# Altium schematic sheet _i2c1.SchDoc
size Tabloid
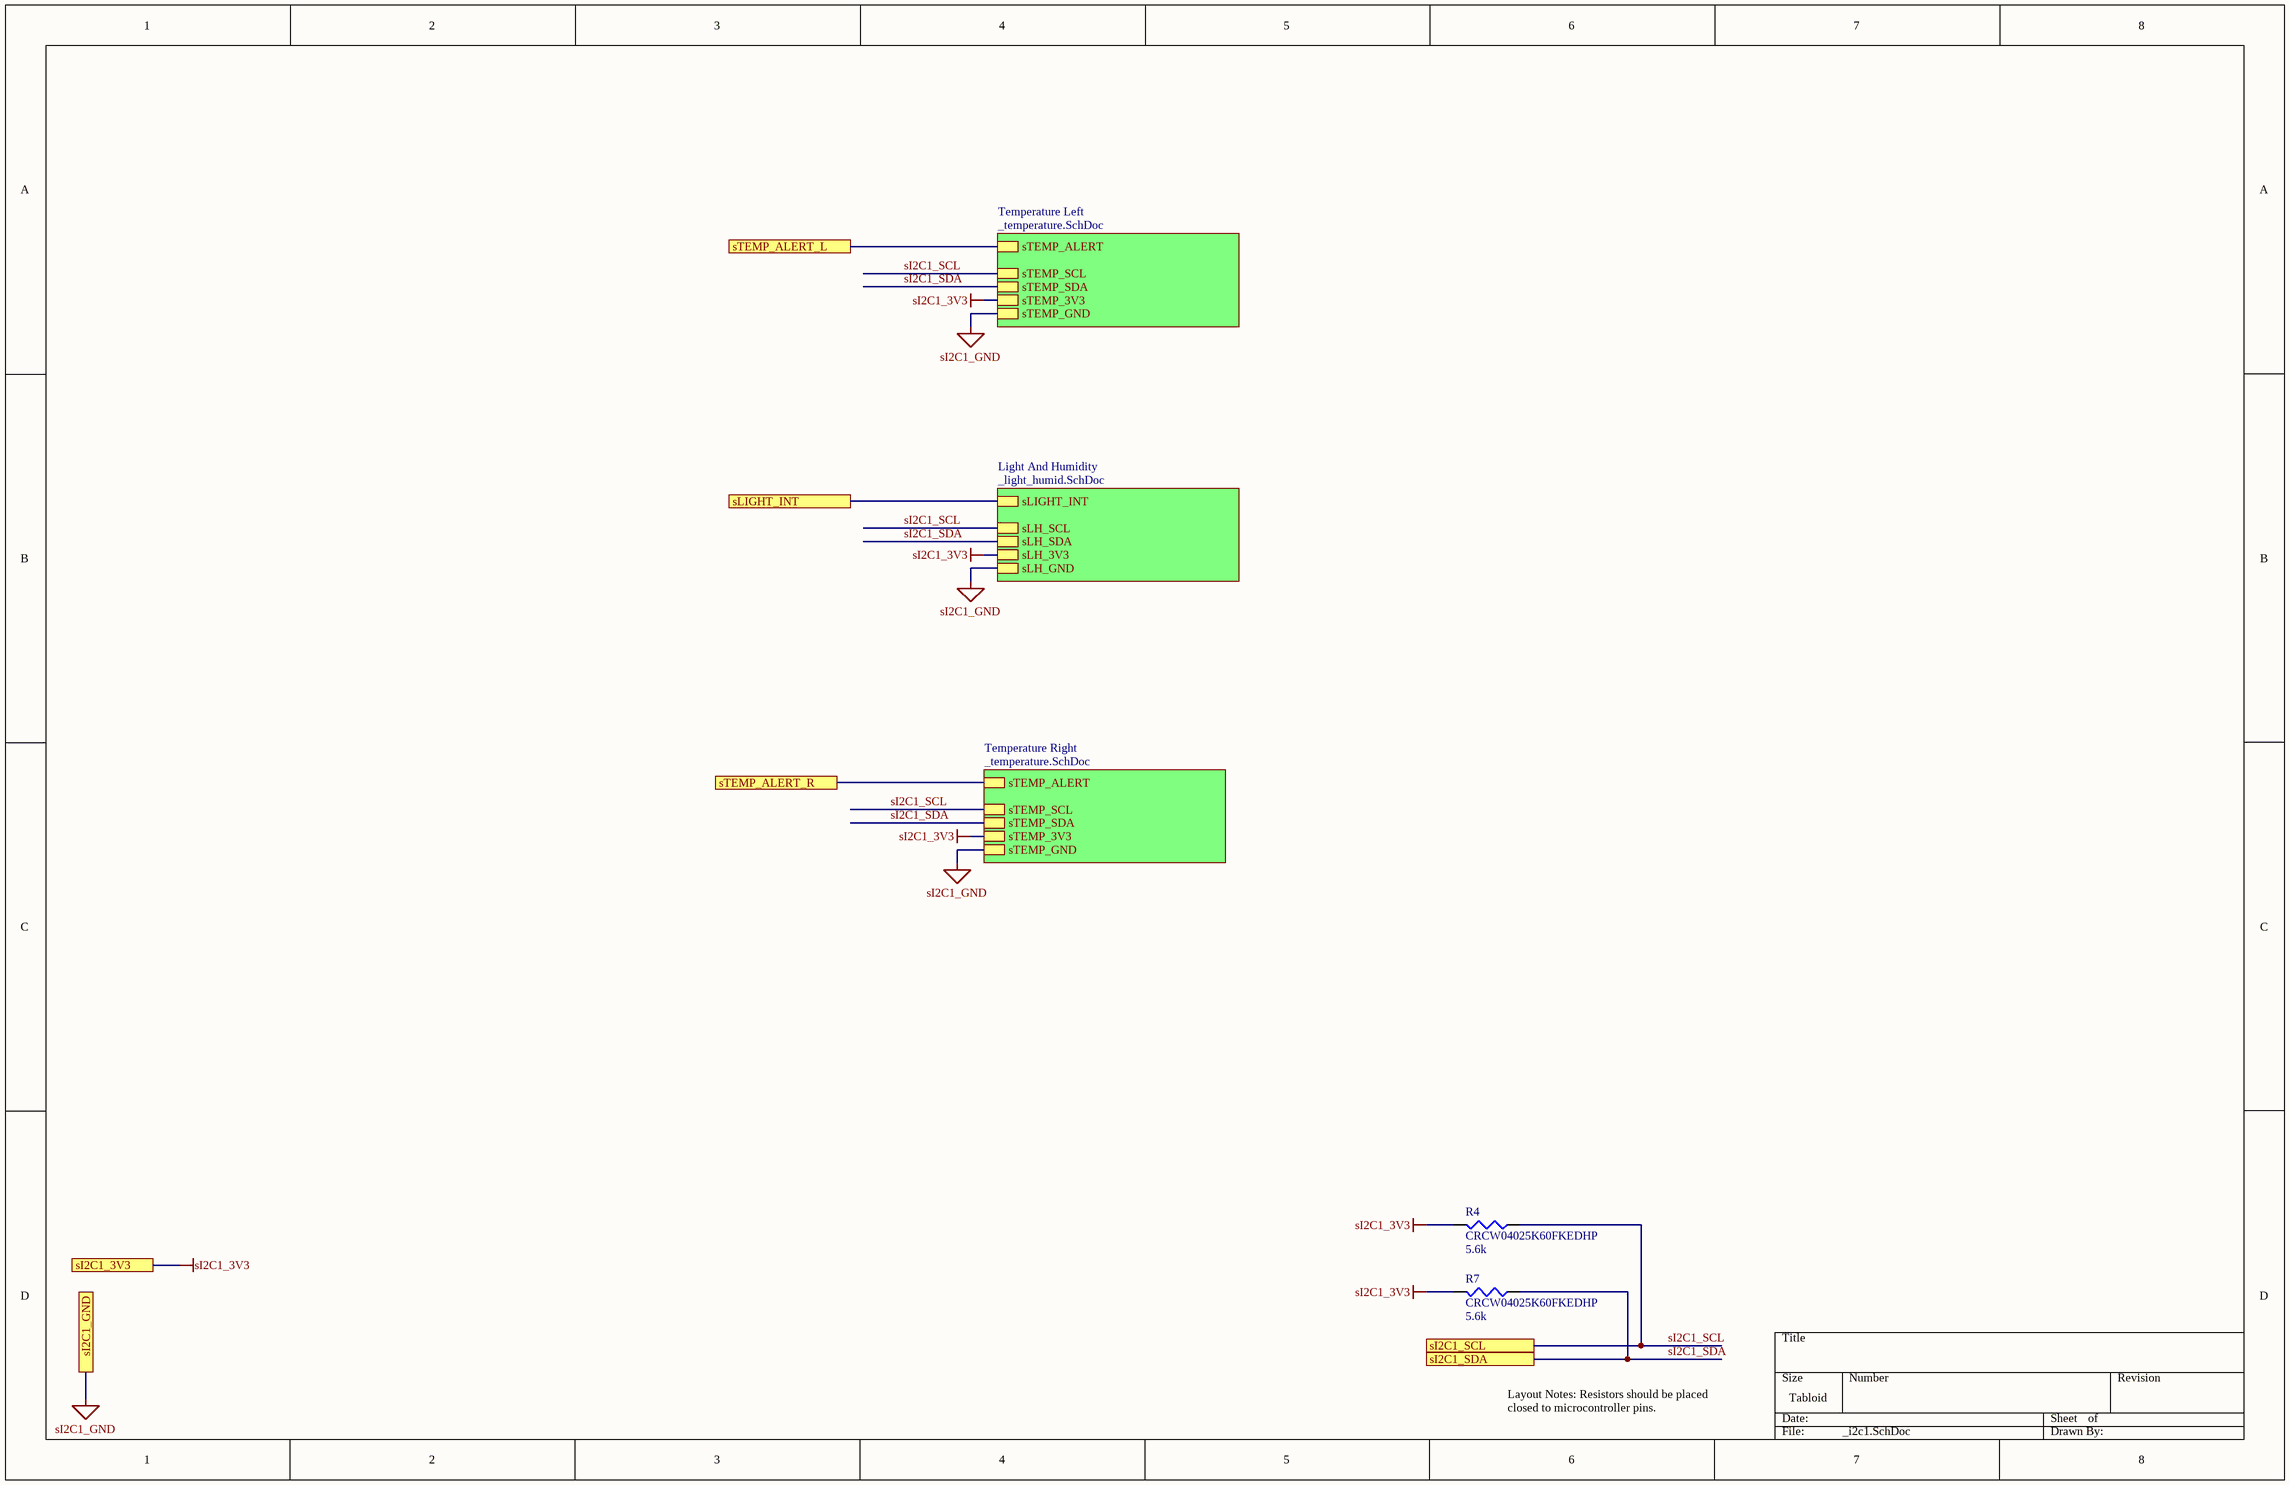
[diagram p0: _i2c1.SchDoc]

## Parts
R4  CRCW04025K60FKEDHP  value 5.6k  [0402]
R7  CRCW04025K60FKEDHP  value 5.6k  [0402]

## Sub-sheets
Light And Humidity = _light_humid.SchDoc: sLH_3V3, sLH_GND, sLH_SCL, sLH_SDA, sLIGHT_INT
Temperature Left = _temperature.SchDoc: sTEMP_3V3, sTEMP_GND, sTEMP_SCL, sTEMP_SDA, sTEMP_ALERT
Temperature Right = _temperature.SchDoc: sTEMP_3V3, sTEMP_GND, sTEMP_SCL, sTEMP_SDA, sTEMP_ALERT

## Ports
sI2C1_3V3, sI2C1_GND, sI2C1_SCL, sI2C1_SDA, sLIGHT_INT, sTEMP_ALERT_L, sTEMP_ALERT_R

## Nets
sI2C1_3V3: R4.2 R7.2 ; port sI2C1_3V3, sheet Light And Humidity/sLH_3V3, sheet Temperature Left/sTEMP_3V3, sheet Temperature Right/sTEMP_3V3
sI2C1_GND: port sI2C1_GND, sheet Light And Humidity/sLH_GND, sheet Temperature Left/sTEMP_GND, sheet Temperature Right/sTEMP_GND
sI2C1_SCL: R4.1 ; port sI2C1_SCL, sheet Light And Humidity/sLH_SCL, sheet Temperature Left/sTEMP_SCL, sheet Temperature Right/sTEMP_SCL
sI2C1_SDA: R7.1 ; port sI2C1_SDA, sheet Light And Humidity/sLH_SDA, sheet Temperature Left/sTEMP_SDA, sheet Temperature Right/sTEMP_SDA
sLIGHT_INT: port sLIGHT_INT, sheet Light And Humidity/sLIGHT_INT
sTEMP_ALERT_L: port sTEMP_ALERT_L, sheet Temperature Left/sTEMP_ALERT
sTEMP_ALERT_R: port sTEMP_ALERT_R, sheet Temperature Right/sTEMP_ALERT

## Notes on the sheet
- Layout Notes: Resistors should be placed closed to microcontroller pins.

## Library data of the parts
R4 R7 = CRCW0402xxxxFKED: 0.125W, -55-155C, 1005, 50V, ±1%